# Altium schematic sheet MCU-io.SchDoc
size A; SheetNumber: 5; SheetTotal: 7
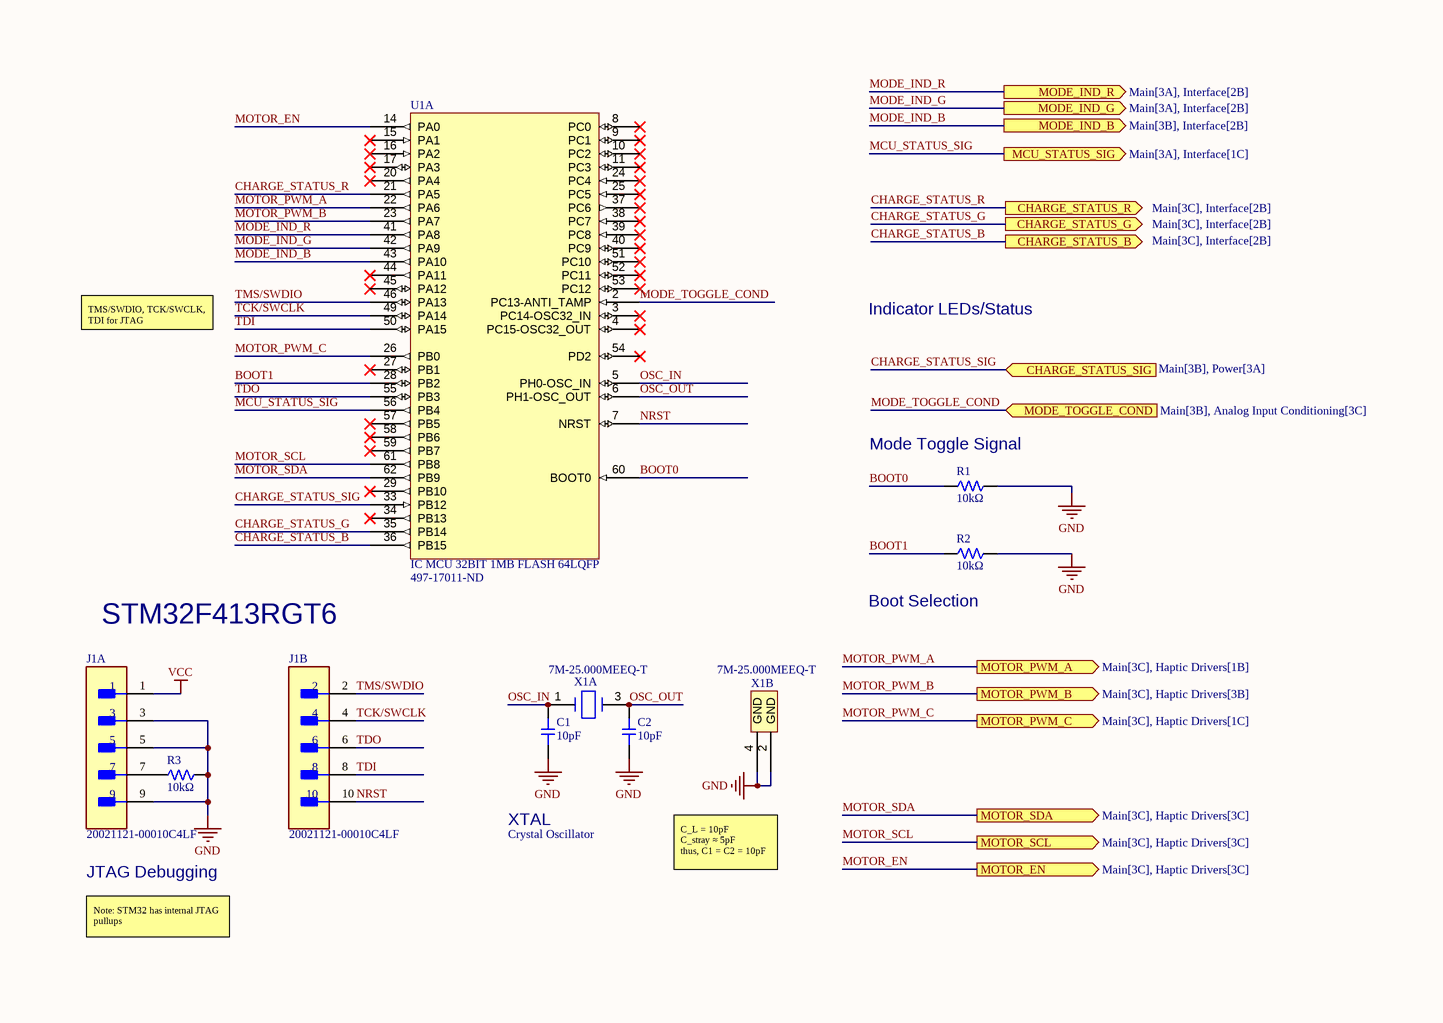
[diagram p0: MCU-io.SchDoc]

## Parts
C1  Capacitance: 10pF  [CAP-0603]  (hidden comment: CL10C100JB8NNNC)
C2  Capacitance: 10pF  [CAP-0603]  (hidden comment: CL10C100JB8NNNC)
J1  20021121-00010C4LF  [FP-20021121-00010C4LF-MFG]  (parts A,B of 2)
R1  Resistance: 10kΩ  [RES-0603]  (hidden comment: 0603WAF1002T5E)
R2  Resistance: 10kΩ  [RES-0603]  (hidden comment: 0603WAF1002T5E)
R3  Resistance: 10kΩ  [RES-0603]  (hidden comment: 0603WAF1002T5E)
U1  IC MCU 32BIT 1MB FLASH 64LQFP  Supplier Part Number 1: 497-17011-ND  [LQFP64-10x10mm]  (part A of 2)
X1  7M-25.000MEEQ-T  [OSCSC320X250X100N]  (parts A,B of 2)

## Ports
CHARGE_STATUS_B (out, see Main[3C], Interface[2B]), CHARGE_STATUS_G (out, see Main[3C], Interface[2B]), CHARGE_STATUS_R (out, see Main[3C], Interface[2B]), CHARGE_STATUS_SIG (in, see Main[3B], Power[3A]), MCU_STATUS_SIG (out, see Main[3A], Interface[1C]), MODE_IND_B (out, see Main[3B], Interface[2B]), MODE_IND_G (out, see Main[3A], Interface[2B]), MODE_IND_R (out, see Main[3A], Interface[2B]), MODE_TOGGLE_COND (in, see Main[3B], Analog Input Conditioning[3C]), MOTOR_EN (out, see Main[3C], Haptic Drivers[3C]), MOTOR_PWM_A (out, see Main[3C], Haptic Drivers[1B]), MOTOR_PWM_B (out, see Main[3C], Haptic Drivers[3B]), MOTOR_PWM_C (out, see Main[3C], Haptic Drivers[1C]), MOTOR_SCL (out, see Main[3C], Haptic Drivers[3C]), MOTOR_SDA (out, see Main[3C], Haptic Drivers[3C])

## Nets
GND: C1.1 C2.1 J1.3 J1.5 J1.9 R1.2 R2.2 R3.2 X1.2(GND) X1.4(GND)
VCC: J1.1
BOOT0: R1.1 U1.60(BOOT0)
BOOT1: R2.1 U1.28(PB2)
CHARGE_STATUS_B: U1.36(PB15) ; port CHARGE_STATUS_B
CHARGE_STATUS_G: U1.35(PB14) ; port CHARGE_STATUS_G
CHARGE_STATUS_R: U1.21(PA5) ; port CHARGE_STATUS_R
CHARGE_STATUS_SIG: U1.33(PB12) ; port CHARGE_STATUS_SIG
MCU_STATUS_SIG: U1.56(PB4) ; port MCU_STATUS_SIG
MODE_IND_B: U1.43(PA10) ; port MODE_IND_B
MODE_IND_G: U1.42(PA9) ; port MODE_IND_G
MODE_IND_R: U1.41(PA8) ; port MODE_IND_R
MODE_TOGGLE_COND: U1.2(PC13-ANTI_TAMP) ; port MODE_TOGGLE_COND
MOTOR_EN: U1.14(PA0) ; port MOTOR_EN
MOTOR_PWM_A: U1.22(PA6) ; port MOTOR_PWM_A
MOTOR_PWM_B: U1.23(PA7) ; port MOTOR_PWM_B
MOTOR_PWM_C: U1.26(PB0) ; port MOTOR_PWM_C
MOTOR_SCL: U1.61(PB8) ; port MOTOR_SCL
MOTOR_SDA: U1.62(PB9) ; port MOTOR_SDA
NRST: J1.10 U1.7(NRST)
OSC_IN: C1.2 U1.5(PH0-OSC_IN) X1.1
OSC_OUT: C2.2 U1.6(PH1-OSC_OUT) X1.3
TCK/SWCLK: J1.4 U1.49(PA14)
TDI: J1.8 U1.50(PA15)
TDO: J1.6 U1.55(PB3)
TMS/SWDIO: J1.2 U1.46(PA13)
NetJ1_7: J1.7 R3.1

Not connected (* = marked no-connect by the designer): U1 3(PC14-OSC32_IN)* 4(PC15-OSC32_OUT)* 8(PC0)* 9(PC1)* 10(PC2)* 11(PC3)* 15(PA1)* 16(PA2)* 17(PA3)* 20(PA4)* 24(PC4)* 25(PC5)* 27(PB1)* 29(PB10)* 34(PB13)* 37(PC6)* 38(PC7)* 39(PC8)* 40(PC9)* 44(PA11)* 45(PA12)* 51(PC10)* 52(PC11)* 53(PC12)* 54(PD2)* 57(PB5)* 58(PB6)* 59(PB7)*

## Notes on the sheet
- TMS/SWDIO, TCK/SWCLK, TDI for JTAG
- Indicator LEDs/Status
- (near R1) Mode Toggle Signal
- STM32F413RGT6
- (near R2) Boot Selection
- XTAL
- Crystal Oscillator
- JTAG Debugging
- C_L = 10pF
  C_stray ≈ 5pF
  thus, C1 = C2 = 10pF
- Note: STM32 has internal JTAG pullups

## Library data of the parts
C1 C2 = CL10C100JB8NNNC: Capacitor, Ceramic (MLCC), 10pF, ±5%, 50V, C0G, ±5%, SMD 0603; Manufacturer: Samsung Electro-Mechanics; Temperature Rating: -55°C ~ 125°C; Impedance (0V Bias) @ 100MHz: 159Ω; Impedance (0V Bias) @ 500MHz: 30.3Ω; Impedance (0V Bias) @ 1GHz: 12.8Ω; Impedance (0V Bias) @ 2GHz: 1.36Ω; Impedance (0V Bias) @ 5GHz: 12.1Ω; Package Size: 0603; JLCPCB Basic Part: Yes; JLCPCB Part Number: C1634; Supplier 1: LCSC; Category: Capacitors - MLCC; Supplier Part Number 1: C1634; Manufacturer Part Number: CL10C100JB8NNNC; Tolerance: ±5%; Voltage Rating: 50V; Temperature Coefficient: C0G; RoHS: Yes; ComponentLink1Description: Datasheet; ComponentLink1URL: https://wmsc.lcsc.com/wmsc/upload/file/pdf/v2/lcsc/2304140030_Samsung-Electro-Mechanics-CL10C100JB8NNNC_C1634.pdf; ComponentLink2Description: JLCPCB Part URL; ComponentLink2URL: https://jlcpcb.com/partdetail/C1634; ComponentLink3Description: LCSC Part URL; ComponentLink3URL: https://lcsc.com/product-detail/Multilayer-Ceramic-Capacitors-MLCC---SMD-SMT_Samsung-Electro-Mechanics-Samsung-Electro-Mechanics-CL10C100JB8NNNC_C1634.html; ComponentLink4Description: Samsung Component Library; ComponentLink4URL: https://weblib.samsungsem.com/mlcc/mlcc-ec.do?partNumber=CL10C100JB8NNN
J1 = CMP-15126-126517171-1: 20021121-00010C4LF Conn Unshrouded Header HDR 10 POS 1.27mm Solder ST Top Entry SMD Minitek127® T/R; Current Rating: 1A; Voltage Rating: 125V; Number of Contacts: 10; Connector Type: Header, Male Pin; Mating Post Length: 3.05mm; Insulation Resistance: 100MΩ; Gender: Male; Contact Resistance: 30mΩ; Stack Height: 3mm; Contact Material: Copper, Gold; Housing Material: Thermoplastic; Number of Pins: 10; Length: 6.35mm; Housing Color: Black; RoHS: Compliant; Max Operating Temperature: 85°C; Min Operating Temperature: -55°C; NexarPartId: 126517171; Mount: Surface Mount; Row Spacing: 1.27mm; Contact Mating Length: 3.048mm; Max Voltage Rating (AC): 125V; Color: Black; Number of Rows: 2; Orientation: Straight; Contact Plating: Gold; Depth: 3.4mm; Pitch: 1.27mm; Height: 4.8mm; Termination: Solder; Radiation Hardening: No; Number of Positions: 10; REACH SVHC: No SVHC
R1-R3 = 0603WAF1002T5E: Resistor, 10kΩ, ±1%, 100mW, 75V, ±100ppm/℃, -55℃~+155℃, SMD 0603; Manufacturer: Uniroyal; Supplier 1: LCSC; Manufacturer Part Number: 0603WAF1002T5E; Supplier Part Number 1: C25804; JLCPCB Part Number: C25804; Power Rating: 100mW; Category: Resistors; Package Size: 0603; JLCPCB Basic Part: Yes; Tolerance: ±1%; Voltage Rating: 75V; Temperature Coefficient: ±100ppm/℃; Temperature Rating: -55℃~+155℃; ComponentLink1Description: Datasheet; ComponentLink1URL: https://wmsc.lcsc.com/wmsc/upload/file/pdf/v2/lcsc/2206010045_UNI-ROYAL-Uniroyal-Elec-0603WAF1002T5E_C25804.pdf; ComponentLink2Description: JLCPCB Part URL; ComponentLink2URL: https://jlcpcb.com/partdetail/C25804
U1 = STM32F4xxR2_minimalist: ARM® Cortex®-M4 STM32F4 Microcontroller IC 32-Bit 100MHz 1MB (1M x 8) FLASH 64-LQFP (10x10); Vendor: STMicroelectronics; C: Copyright (C) 2016 Accelerated Designs. All rights reserved; Manufacturer_Part_Number: stm32f4xxr2; Copyright: Copyright (C) 2016 Accelerated Designs. All rights reserved; RefDes: RefDes; Type: Type; Value: Value; Supplier 1: Digi-Key
X1 = 7M-25.000MEEQ-T: CRYSTAL 25.0000MHZ 10PF SMD; Manufacturer 1: TXC; Frequency: 25MHz; Frequency Tolerance: 10ppm; ESR (Equivalent Series Resistance): 60R; Supplier 1: Digi-Key; Supplier Part Number 1: 887-1326-1-ND; Manufacturer Part Number 1: 7M-25.000MEEQ-T; Stock 1: 17097; Pricing 1: 1=1.27, 10=1.209, 50=1.1812, 100=1.0125, 500=0.9844, 1000=0.8297 (USD); Mount: Surface Mount; Case/Package: SMD/SMT; Number of Pins: 4; Min Operating Temperature: -20°C; Max Operating Temperature: 70°C; Load Capacitance: 10pF; Packaging: Tape and Reel; Package Quantity: 3000; Tolerance: 10ppm; Frequency Stability: 10ppm; Termination: SMD/SMT; Length: 3.2mm; Height: 0.031inch; Width: 0.098inch; Depth: 2.5mm; REACH SVHC: No SVHC; ComponentLink1URL: https://datasheet.ciiva.com/26918/getdatasheetpartid-757227-26918816.pdf; ComponentLink1Description: https://datasheet.ciiva.com/26918/getdatasheetpartid-757227-26918816.pdf; ComponentLink2URL: https://datasheet.ciiva.com/856/7m-accuracy-856022.pdf; ComponentLink2Description: https://datasheet.ciiva.com/856/7m-accuracy-856022.pdf; ComponentLink3URL: https://datasheet.ciiva.com/22658/1794111-22658486.pdf; ComponentLink3Description: https://datasheet.ciiva.com/22658/1794111-22658486.pdf; ComponentLink4URL: https://datasheet.ciiva.com/856/7m-accuracy-856023.pdf; ComponentLink4Description: https://datasheet.ciiva.com/856/7m-accuracy-856023.pdf; ComponentLink5URL: https://datasheet.ciiva.com/856/7m-accuracy-856024.pdf; ComponentLink5Description: https://datasheet.ciiva.com/856/7m-accuracy-856024.pdf; ComponentLink6URL: https://datasheet.ciiva.com/4946/7m-11184-4946126.pdf; ComponentLink6Description: https://datasheet.ciiva.com/4946/7m-11184-4946126.pdf; ComponentLink7URL: https://datasheet.ciiva.com/28498/1794111-28498878.pdf; ComponentLink7Description: https://datasheet.ciiva.com/28498/1794111-28498878.pdf